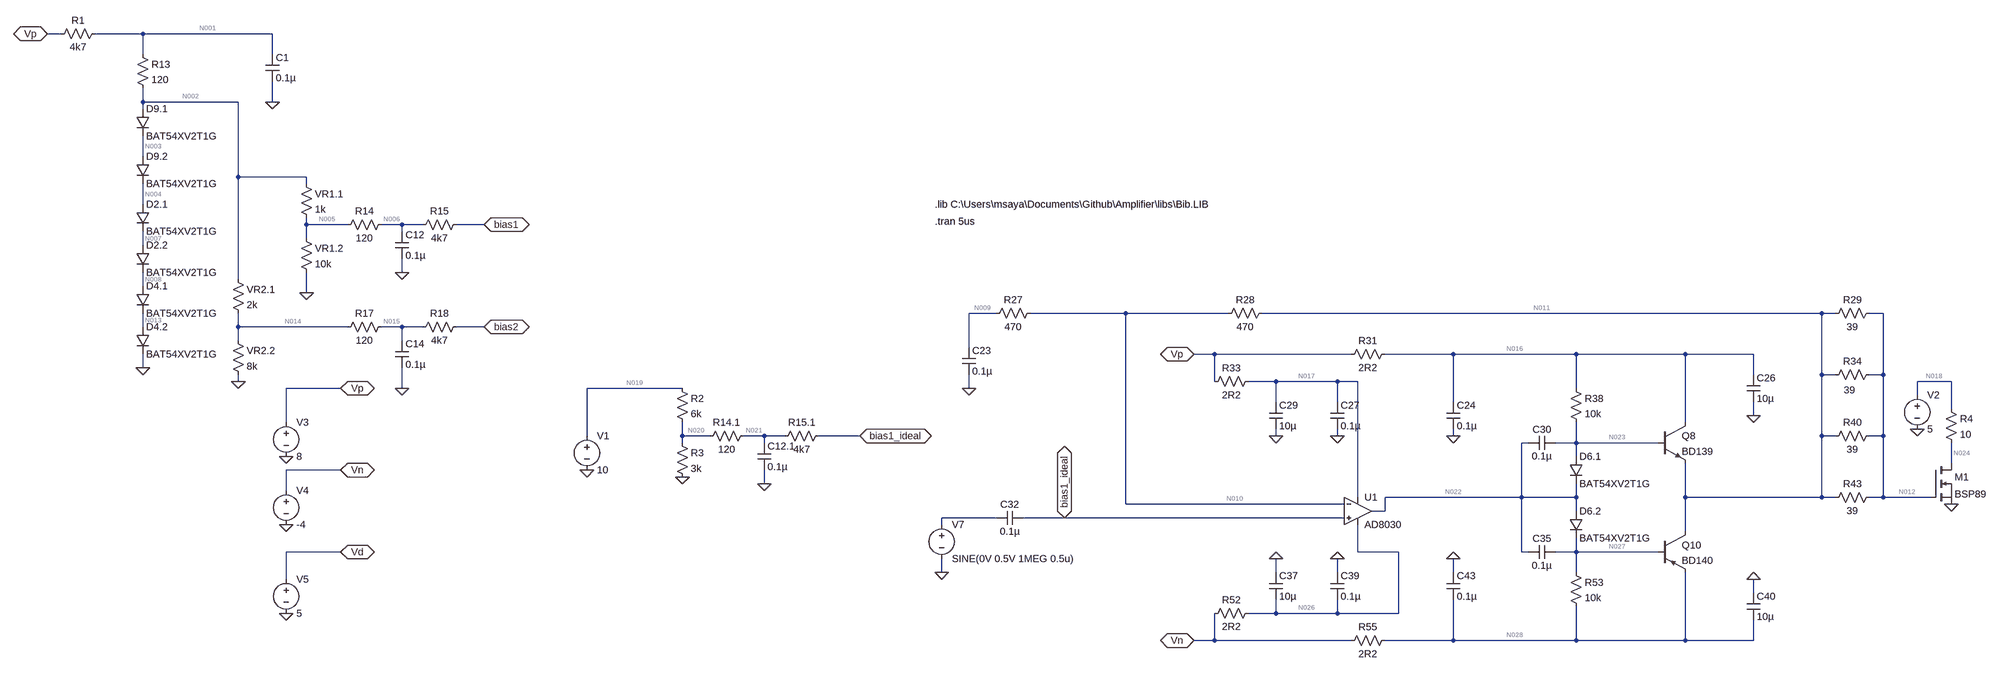
[diagram p0: schematic nicht_inv.asc]
nicht_inv.asc, the LTspice schematic file:
Version 4
SHEET 1 4920 3300
WIRE -2624 1072 -2656 1072
WIRE -2432 1072 -2544 1072
WIRE -2128 1072 -2432 1072
WIRE -2432 1120 -2432 1072
WIRE -2128 1120 -2128 1072
WIRE -2432 1232 -2432 1200
WIRE -2208 1232 -2432 1232
WIRE -2128 1232 -2128 1184
WIRE -2432 1248 -2432 1232
WIRE -2432 1360 -2432 1312
WIRE -2208 1408 -2208 1232
WIRE -2048 1408 -2208 1408
WIRE -2048 1424 -2048 1408
WIRE -2432 1472 -2432 1424
WIRE -2048 1520 -2048 1504
WIRE -1952 1520 -2048 1520
WIRE -1824 1520 -1872 1520
WIRE -1776 1520 -1824 1520
WIRE -1632 1520 -1696 1520
WIRE -1824 1536 -1824 1520
WIRE -2048 1552 -2048 1520
WIRE -2432 1568 -2432 1536
WIRE -1824 1632 -1824 1600
WIRE -2208 1648 -2208 1408
WIRE -2432 1664 -2432 1632
WIRE -2048 1680 -2048 1632
WIRE 608 1728 544 1728
WIRE 912 1728 688 1728
WIRE 1152 1728 912 1728
WIRE 2544 1728 1232 1728
WIRE 2576 1728 2544 1728
WIRE 2688 1728 2656 1728
WIRE -2432 1760 -2432 1728
WIRE -2208 1760 -2208 1728
WIRE -1952 1760 -2208 1760
WIRE -1824 1760 -1872 1760
WIRE -1776 1760 -1824 1760
WIRE -1632 1760 -1696 1760
WIRE -2208 1792 -2208 1760
WIRE -1824 1792 -1824 1760
WIRE 544 1808 544 1728
WIRE 1120 1824 1072 1824
WIRE 1440 1824 1120 1824
WIRE 1680 1824 1520 1824
WIRE 1968 1824 1680 1824
WIRE 2224 1824 1968 1824
WIRE 2384 1824 2224 1824
WIRE -2432 1856 -2432 1824
WIRE 2384 1872 2384 1824
WIRE 2544 1872 2544 1728
WIRE 2576 1872 2544 1872
WIRE 2688 1872 2688 1728
WIRE 2688 1872 2656 1872
WIRE -2208 1888 -2208 1872
WIRE 1120 1888 1120 1824
WIRE 1264 1888 1200 1888
WIRE 1408 1888 1264 1888
WIRE 1456 1888 1408 1888
WIRE 2848 1888 2768 1888
WIRE -1968 1904 -2096 1904
WIRE -1824 1904 -1824 1856
WIRE -128 1904 -352 1904
WIRE 544 1904 544 1872
WIRE 1968 1904 1968 1824
WIRE 2768 1920 2768 1888
WIRE 1264 1936 1264 1888
WIRE 1408 1936 1408 1888
WIRE 1680 1936 1680 1824
WIRE 2848 1952 2848 1888
WIRE 2384 1968 2384 1936
WIRE -2096 1984 -2096 1904
WIRE 2224 1984 2224 1824
WIRE -352 2016 -352 1904
WIRE -128 2016 -128 1984
WIRE -64 2016 -128 2016
WIRE 64 2016 16 2016
WIRE 112 2016 64 2016
WIRE 288 2016 192 2016
WIRE 1264 2016 1264 2000
WIRE 1408 2016 1408 2000
WIRE 1680 2016 1680 2000
WIRE 2544 2016 2544 1872
WIRE 2576 2016 2544 2016
WIRE 2688 2016 2688 1872
WIRE 2688 2016 2656 2016
WIRE -128 2032 -128 2016
WIRE 64 2032 64 2016
WIRE 1856 2032 1840 2032
WIRE 1968 2032 1968 1984
WIRE 1968 2032 1920 2032
WIRE 2160 2032 1968 2032
WIRE 1968 2064 1968 2032
WIRE 2848 2080 2848 2032
WIRE -1968 2096 -2096 2096
WIRE 64 2128 64 2096
WIRE -2096 2144 -2096 2096
WIRE 1456 2160 1456 1888
WIRE 1840 2160 1840 2032
WIRE 1840 2160 1520 2160
WIRE 1968 2160 1968 2128
WIRE 1968 2160 1840 2160
WIRE 2224 2160 2224 2080
WIRE 2544 2160 2544 2016
WIRE 2544 2160 2224 2160
WIRE 2576 2160 2544 2160
WIRE 2688 2160 2688 2016
WIRE 2688 2160 2656 2160
WIRE 2800 2160 2688 2160
WIRE 912 2176 912 1728
WIRE 1424 2176 912 2176
WIRE 1520 2192 1520 2160
WIRE 1520 2192 1488 2192
WIRE 1968 2192 1968 2160
WIRE 608 2208 480 2208
WIRE 768 2208 672 2208
WIRE 1424 2208 768 2208
WIRE 480 2224 480 2208
WIRE 2224 2240 2224 2160
WIRE -1968 2288 -2096 2288
WIRE 1456 2288 1456 2224
WIRE 1552 2288 1456 2288
WIRE 1840 2288 1840 2160
WIRE 1856 2288 1840 2288
WIRE 1968 2288 1968 2256
WIRE 1968 2288 1920 2288
WIRE 2160 2288 1968 2288
WIRE 480 2336 480 2304
WIRE 1264 2336 1264 2304
WIRE 1408 2336 1408 2304
WIRE 1680 2336 1680 2304
WIRE 1968 2336 1968 2288
WIRE -2096 2352 -2096 2288
WIRE 2384 2384 2384 2352
WIRE 1264 2432 1264 2400
WIRE 1264 2432 1200 2432
WIRE 1408 2432 1408 2400
WIRE 1408 2432 1264 2432
WIRE 1552 2432 1552 2288
WIRE 1552 2432 1408 2432
WIRE 1120 2496 1120 2432
WIRE 1120 2496 1072 2496
WIRE 1440 2496 1120 2496
WIRE 1680 2496 1680 2400
WIRE 1680 2496 1520 2496
WIRE 1968 2496 1968 2416
WIRE 1968 2496 1680 2496
WIRE 2224 2496 2224 2336
WIRE 2224 2496 1968 2496
WIRE 2384 2496 2384 2448
WIRE 2384 2496 2224 2496
FLAG -1968 1904 Vp
IOPIN -1968 1904 BiDir
FLAG -1968 2096 Vn
IOPIN -1968 2096 BiDir
FLAG -1968 2288 Vd
IOPIN -1968 2288 BiDir
FLAG -2096 2064 0
FLAG -2096 2224 0
FLAG -2096 2432 0
FLAG 480 2336 0
FLAG 1072 1824 Vp
IOPIN 1072 1824 BiDir
FLAG 1408 2016 0
FLAG 1264 2016 0
FLAG 544 1904 0
FLAG 1072 2496 Vn
IOPIN 1072 2496 BiDir
FLAG 1408 2304 0
FLAG 1264 2304 0
FLAG 1680 2304 0
FLAG 1680 2016 0
FLAG 2384 1968 0
FLAG 2384 2352 0
FLAG -2656 1072 Vp
IOPIN -2656 1072 BiDir
FLAG -2128 1232 0
FLAG -1824 1632 0
FLAG -2208 1888 0
FLAG -2432 1856 0
FLAG -1824 1904 0
FLAG -2048 1680 0
FLAG -1632 1520 bias1
IOPIN -1632 1520 BiDir
FLAG -1632 1760 bias2
IOPIN -1632 1760 BiDir
FLAG -352 2096 0
FLAG -128 2112 0
FLAG 288 2016 bias1_ideal
IOPIN 288 2016 BiDir
FLAG 2848 2176 0
FLAG 2768 2000 0
FLAG 768 2208 bias1_ideal
IOPIN 768 2208 BiDir
FLAG 64 2128 0
SYMBOL voltage -2096 1968 R0
WINDOW 123 0 0 Left 0
WINDOW 39 0 0 Left 0
SYMATTR InstName V3
SYMATTR Value 8
SYMBOL voltage -2096 2128 R0
WINDOW 123 0 0 Left 0
WINDOW 39 0 0 Left 0
SYMATTR InstName V4
SYMATTR Value -4
SYMBOL voltage -2096 2336 R0
WINDOW 123 0 0 Left 0
WINDOW 39 0 0 Left 0
SYMATTR InstName V5
SYMATTR Value 5
SYMBOL voltage 480 2208 R0
WINDOW 123 0 0 Left 0
WINDOW 39 0 0 Left 0
SYMATTR InstName V7
SYMATTR Value SINE(0V 0.5V 1MEG 0.5u)
SYMBOL cap 528 1808 R0
SYMATTR InstName C23
SYMATTR Value 0.1µ
SYMBOL cap 1248 1936 R0
SYMATTR InstName C29
SYMATTR Value 10µ
SYMBOL cap 1392 1936 R0
SYMATTR InstName C27
SYMATTR Value 0.1µ
SYMBOL cap 1248 2336 R0
SYMATTR InstName C37
SYMATTR Value 10µ
SYMBOL cap 1392 2336 R0
SYMATTR InstName C39
SYMATTR Value 0.1µ
SYMBOL cap 1664 1936 R0
SYMATTR InstName C24
SYMATTR Value 0.1µ
SYMBOL cap 1664 2336 R0
SYMATTR InstName C43
SYMATTR Value 0.1µ
SYMBOL cap 1920 2016 R90
WINDOW 0 0 32 VBottom 2
WINDOW 3 32 32 VTop 2
SYMATTR InstName C30
SYMATTR Value 0.1µ
SYMBOL cap 1920 2272 R90
WINDOW 0 0 32 VBottom 2
WINDOW 3 32 32 VTop 2
SYMATTR InstName C35
SYMATTR Value 0.1µ
SYMBOL cap 2368 1872 R0
SYMATTR InstName C26
SYMATTR Value 10µ
SYMBOL cap 2368 2384 R0
SYMATTR InstName C40
SYMATTR Value 10µ
SYMBOL res 1952 1888 R0
SYMATTR InstName R38
SYMATTR Value 10k
SYMBOL res 1952 2320 R0
SYMATTR InstName R53
SYMATTR Value 10k
SYMBOL res 1536 2480 R90
WINDOW 0 0 56 VBottom 2
WINDOW 3 32 56 VTop 2
SYMATTR InstName R55
SYMATTR Value 2R2
SYMBOL res 1216 2416 R90
WINDOW 0 0 56 VBottom 2
WINDOW 3 32 56 VTop 2
SYMATTR InstName R52
SYMATTR Value 2R2
SYMBOL res 1216 1872 R90
WINDOW 0 0 56 VBottom 2
WINDOW 3 32 56 VTop 2
SYMATTR InstName R33
SYMATTR Value 2R2
SYMBOL res 704 1712 R90
WINDOW 0 0 56 VBottom 2
WINDOW 3 32 56 VTop 2
SYMATTR InstName R27
SYMATTR Value 470
SYMBOL res 1248 1712 R90
WINDOW 0 0 56 VBottom 2
WINDOW 3 32 56 VTop 2
SYMATTR InstName R28
SYMATTR Value 470
SYMBOL res 1536 1808 R90
WINDOW 0 0 56 VBottom 2
WINDOW 3 32 56 VTop 2
SYMATTR InstName R31
SYMATTR Value 2R2
SYMBOL diode 1952 2064 R0
SYMATTR InstName D6.1
SYMATTR Value BAT54XV2T1G
SYMBOL diode 1952 2192 R0
SYMATTR InstName D6.2
SYMATTR Value BAT54XV2T1G
SYMBOL npn 2160 1984 R0
SYMATTR InstName Q8
SYMATTR Value BD139
SYMBOL pnp 2160 2240 R0
SYMATTR InstName Q10
SYMATTR Value BD140
SYMBOL res 2672 1712 R90
WINDOW 0 0 56 VBottom 2
WINDOW 3 32 56 VTop 2
SYMATTR InstName R29
SYMATTR Value 39
SYMBOL res 2672 1856 R90
WINDOW 0 0 56 VBottom 2
WINDOW 3 37 63 VTop 2
SYMATTR InstName R34
SYMATTR Value 39
SYMBOL res 2672 2000 R90
WINDOW 0 0 56 VBottom 2
WINDOW 3 32 56 VTop 2
SYMATTR InstName R40
SYMATTR Value 39
SYMBOL res 2672 2144 R90
WINDOW 0 0 56 VBottom 2
WINDOW 3 32 56 VTop 2
SYMATTR InstName R43
SYMATTR Value 39
SYMBOL res -2528 1056 R90
WINDOW 0 0 56 VBottom 2
WINDOW 3 32 56 VTop 2
SYMATTR InstName R1
SYMATTR Value 4k7
SYMBOL res -1856 1504 R90
WINDOW 0 0 56 VBottom 2
WINDOW 3 32 56 VTop 2
SYMATTR InstName R14
SYMATTR Value 120
SYMBOL res -1680 1504 R90
WINDOW 0 0 56 VBottom 2
WINDOW 3 32 56 VTop 2
SYMATTR InstName R15
SYMATTR Value 4k7
SYMBOL res -1856 1744 R90
WINDOW 0 0 56 VBottom 2
WINDOW 3 32 56 VTop 2
SYMATTR InstName R17
SYMATTR Value 120
SYMBOL res -1680 1744 R90
WINDOW 0 0 56 VBottom 2
WINDOW 3 32 56 VTop 2
SYMATTR InstName R18
SYMATTR Value 4k7
SYMBOL res -2448 1104 R0
SYMATTR InstName R13
SYMATTR Value 120
SYMBOL cap -2144 1120 R0
SYMATTR InstName C1
SYMATTR Value 0.1µ
SYMBOL diode -2448 1248 R0
SYMATTR InstName D9.1
SYMATTR Value BAT54XV2T1G
SYMBOL diode -2448 1360 R0
SYMATTR InstName D9.2
SYMATTR Value BAT54XV2T1G
SYMBOL diode -2448 1472 R0
SYMATTR InstName D2.1
SYMATTR Value BAT54XV2T1G
SYMBOL diode -2448 1568 R0
SYMATTR InstName D2.2
SYMATTR Value BAT54XV2T1G
SYMBOL diode -2448 1664 R0
SYMATTR InstName D4.1
SYMATTR Value BAT54XV2T1G
SYMBOL diode -2448 1760 R0
SYMATTR InstName D4.2
SYMATTR Value BAT54XV2T1G
SYMBOL OpAmps\\AD8030 1456 2128 R0
SYMATTR InstName U1
SYMBOL cap -1840 1536 R0
SYMATTR InstName C12
SYMATTR Value 0.1µ
SYMBOL cap -1840 1792 R0
SYMATTR InstName C14
SYMATTR Value 0.1µ
SYMBOL res -2064 1408 R0
SYMATTR InstName VR1.1
SYMATTR Value 1k
SYMBOL res -2064 1536 R0
SYMATTR InstName VR1.2
SYMATTR Value 10k
SYMBOL res -2224 1632 R0
SYMATTR InstName VR2.1
SYMATTR Value 2k
SYMBOL res -2224 1776 R0
SYMATTR InstName VR2.2
SYMATTR Value 8k
SYMBOL voltage -352 2000 R0
WINDOW 123 0 0 Left 0
WINDOW 39 0 0 Left 0
SYMATTR InstName V1
SYMATTR Value 10
SYMBOL res -144 1888 R0
SYMATTR InstName R2
SYMATTR Value 6k
SYMBOL res -144 2016 R0
SYMATTR InstName R3
SYMATTR Value 3k
SYMBOL nmos 2800 2080 R0
SYMATTR InstName M1
SYMATTR Value BSP89
SYMBOL res 2832 1936 R0
SYMATTR InstName R4
SYMATTR Value 10
SYMBOL voltage 2768 1904 R0
WINDOW 123 0 0 Left 0
WINDOW 39 0 0 Left 0
SYMATTR InstName V2
SYMATTR Value 5
SYMBOL res 32 2000 R90
WINDOW 0 0 56 VBottom 2
WINDOW 3 32 56 VTop 2
SYMATTR InstName R14.1
SYMATTR Value 120
SYMBOL res 208 2000 R90
WINDOW 0 0 56 VBottom 2
WINDOW 3 32 56 VTop 2
SYMATTR InstName R15.1
SYMATTR Value 4k7
SYMBOL cap 48 2032 R0
SYMATTR InstName C12.1
SYMATTR Value 0.1µ
SYMBOL cap 672 2192 R90
WINDOW 0 0 32 VBottom 2
WINDOW 3 32 32 VTop 2
SYMATTR InstName C32
SYMATTR Value 0.1µ
TEXT 464 1512 Left 2 !.tran 5us
TEXT 464 1472 Left 2 !.lib C:\\Users\\msaya\\Documents\\Github\\Amplifier\\libs\\Bib.LIB

The netlist it stands for:
* nicht_inv.asc
V3 Vp 0 8
V4 Vn 0 -4
V5 Vd 0 5
V7 N025 0 SINE(0V 0.5V 1MEG 0.5u)
C23 N009 0 0.1µ
C29 N017 0 10µ
C27 N017 0 0.1µ
C37 0 N026 10µ
C39 0 N026 0.1µ
C24 N016 0 0.1µ
C43 0 N028 0.1µ
C30 N023 N022 0.1µ
C35 N027 N022 0.1µ
C26 N016 0 10µ
C40 0 N028 10µ
R38 N016 N023 10k
R53 N027 N028 10k
R55 N028 Vn 2R2
R52 N026 Vn 2R2
R33 N017 Vp 2R2
R27 N010 N009 470
R28 N011 N010 470
R31 N016 Vp 2R2
D6.1 N023 N022 BAT54XV2T1G
D6.2 N022 N027 BAT54XV2T1G
Q8 N016 N023 N011 0 BD139
Q10 N011 N027 N028 0 BD140
R29 N012 N011 39
R34 N012 N011 39
R40 N012 N011 39
R43 N012 N011 39
R1 N001 Vp 4k7
R14 N006 N005 120
R15 bias1 N006 4k7
R17 N015 N014 120
R18 bias2 N015 4k7
R13 N001 N002 120
C1 N001 0 0.1µ
D9.1 N002 N003 BAT54XV2T1G
D9.2 N003 N004 BAT54XV2T1G
D2.1 N004 N007 BAT54XV2T1G
D2.2 N007 N008 BAT54XV2T1G
D4.1 N008 N013 BAT54XV2T1G
D4.2 N013 0 BAT54XV2T1G
XU1 bias1_ideal N010 N017 N026 N022 AD8040  ; AD8030, pins In+ In- V+ V- OUT
C12 N006 0 0.1µ
C14 N015 0 0.1µ
R§VR1.1 N002 N005 1k
R§VR1.2 N005 0 10k
R§VR2.1 N002 N014 2k
R§VR2.2 N014 0 8k
V1 N019 0 10
R2 N019 N020 6k
R3 N020 0 3k
M1 N024 N012 0 0 BSP89
R4 N018 N024 10
V2 N018 0 5
R14.1 N021 N020 120
R15.1 bias1_ideal N021 4k7
C12.1 N021 0 0.1µ
C32 bias1_ideal N025 0.1µ
.model D D
.lib standard.dio
.model NPN NPN
.model PNP PNP
.lib standard.bjt
.model NMOS NMOS
.model PMOS PMOS
.lib standard.mos
.tran 5us
.lib C:\Users\msaya\Documents\Github\Amplifier\libs\Bib.LIB
.lib ADI.lib
.backanno
.end

* Results of the author's LTspice run, read from the files saved beside the schematic
* Operating Point, zero values left out:
*   V(vp) = 8 V
*   V(vn) = -4 V
*   V(vd) = 5 V
*   V(n009) = 3.343 V
*   V(n017) = 7.997 V
*   V(n026) = -3.997 V
*   V(n016) = 7.999 V
*   V(n028) = -3.998 V
*   V(n023) = 3.549 V
*   V(n022) = 3.293 V
*   V(n027) = 3.024 V
*   V(n010) = 3.343 V
*   V(n011) = 3.343 V
*   V(n012) = 3.343 V
*   V(n001) = 1.821 V
*   V(n006) = 1.512 V
*   V(n005) = 1.512 V
*   V(bias1) = 1.512 V
*   V(n015) = 1.331 V
*   V(n014) = 1.331 V
*   V(bias2) = 1.331 V
*   V(n002) = 1.664 V
*   V(n003) = 1.386 V
*   V(n004) = 1.109 V
*   V(n007) = 831.8 mV
*   V(n008) = 554.5 mV
*   V(n013) = 277.3 mV
*   V(bias1_ideal) = 3.343 V
*   V(n019) = 10 V
*   V(n020) = 3.336 V
*   V(n024) = 1.646 V
*   V(n018) = 5 V
*   V(n021) = 3.336 V
*   Ic(Q8) = 13.26 µA
*   Ib(Q8) = 1.257 µA
*   Ie(Q8) = -14.52 µA
*   Ic(Q10) = 15.99 µA
*   Ib(Q10) = -353.8 nA
*   Ie(Q10) = -15.64 µA
*   Id(M1) = 335.4 mA
*   Is(M1) = -335.4 mA
*   I(D6.1) = 443.8 µA
*   I(D6.2) = 701.9 µA
*   I(D9.1) = 997 µA
*   I(D9.2) = 997 µA
*   I(D2.1) = 997 µA
*   I(D2.2) = 997 µA
*   I(D4.1) = 997 µA
*   I(D4.2) = 997 µA
*   I(R38) = 445 µA
*   I(R53) = 702.3 µA
*   I(R55) = 717.9 µA
*   I(R52) = 1.324 mA
*   I(R33) = -1.585 mA
*   I(R28) = -1.476 µA
*   I(R31) = -458.3 µA
*   I(R1) = -1.315 mA
*   I(R13) = 1.315 mA
*   I(Vr1.1) = 151.2 µA
*   I(Vr1.2) = 151.2 µA
*   I(Vr2.1) = 166.4 µA
*   I(Vr2.2) = 166.4 µA
*   I(R2) = 1.111 mA
*   I(R3) = 1.112 mA
*   I(R4) = 335.4 mA
*   I(R14.1) = 1.476 µA
*   I(R15.1) = 1.476 µA
*   I(V3) = -3.358 mA
*   I(V4) = 2.042 mA
*   I(V1) = -1.111 mA
*   I(V2) = -335.4 mA
*   Ix(u1:1) = -1.476 µA
*   Ix(u1:2) = -1.476 µA
*   Ix(u1:3) = 1.585 mA
*   Ix(u1:4) = -1.324 mA
*   Ix(u1:5) = -258.2 µA
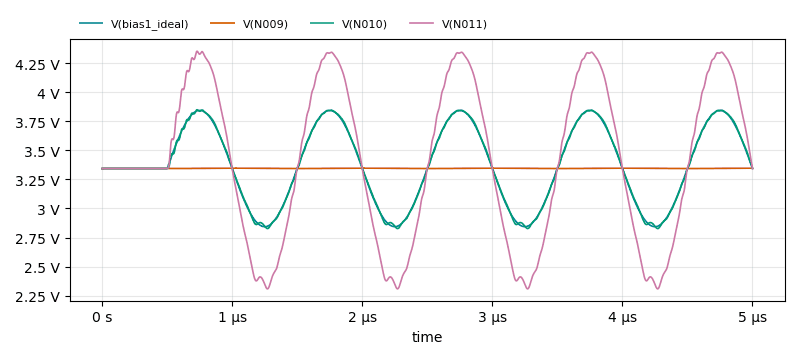
[diagram p1: Transient Analysis of nicht_inv.asc, plotted from the saved traces]
* Transient Analysis, 1 run:
*   V(bias1_ideal): min 2.843 V, max 3.843 V, average 3.375 V, rms 3.392 V, last 3.343 V
*   V(N009): min 3.343 V, max 3.347 V, average 3.345 V, rms 3.345 V, last 3.347 V
*   V(N010): min 2.827 V, max 3.849 V, average 3.375 V, rms 3.392 V, last 3.346 V
*   V(N011): min 2.309 V, max 4.352 V, average 3.405 V, rms 3.47 V, last 3.341 V